# Altium schematic sheet external.SchDoc
size A4; Organization: GPA Robotics; Revision: REV 0
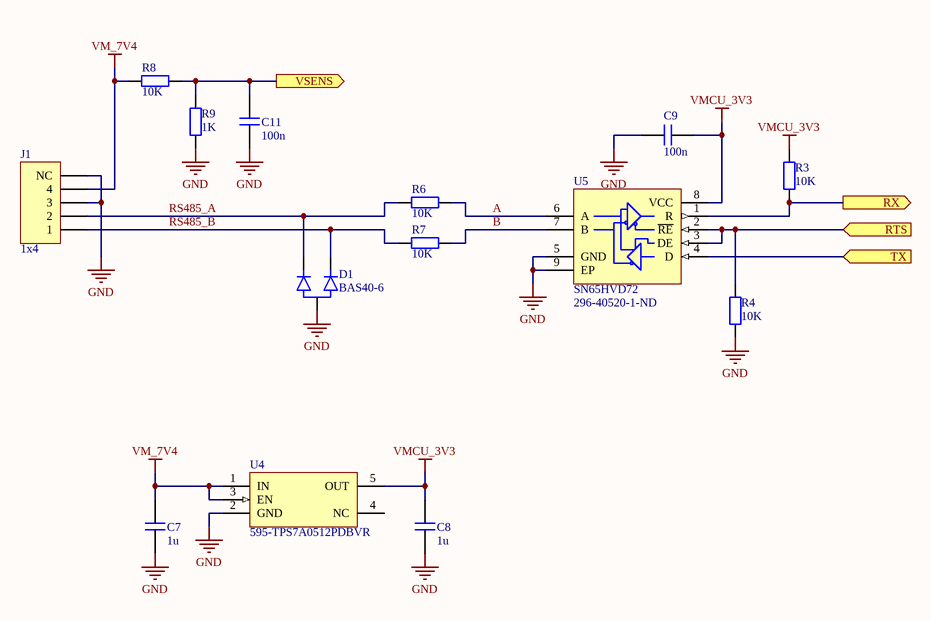
[diagram p0: external.SchDoc]

## Parts
C7  value 1u  [CAPC2012X11N]  (hidden comment: cap)
C8  value 1u  [CAPC2012X11N]  (hidden comment: cap)
C9  value 100n  [CAPC1005X06N]  (hidden comment: cap)
C11  value 100n  [CAPC1005X06N]  (hidden comment: cap)
D1  BAS40-6  [SOT23_CA]
J1  1x4  [sm04b-pass]
R3  value 10K  [RESC1005X04N]  (hidden comment: res)
R4  value 10K  [RESC1005X04N]  (hidden comment: res)
R6  value 10K  [RESC1005X04N]  (hidden comment: res)
R7  value 10K  [RESC1005X04N]  (hidden comment: res)
R8  value 10K  [RESC1005X04N]  (hidden comment: res)
R9  value 1K  [RESC1005X04N]  (hidden comment: res)
U4  595-TPS7A0512PDBVR  [SOT95P280X145-5N]
U5  SN65HVD72  Supplier Part Number 1: 296-40520-1-ND  [SON65P300X100_HS-9N]

## Ports
RTS (in), RX (out), TX (in), VSENS (out)

## Nets
GND: C7.1 C8.1 C9.2 C11.1 D1.A J1.3 J1.ANCHOR(NC) R4.1 R9.1 U4.2(GND) U5.5(GND) U5.9(EP)
VM_7V4: C7.2 J1.4 R8.2 U4.1(IN) U4.3(EN)
VMCU_3V3: C8.2 C9.1 R3.2 U4.5(OUT) U5.8(VCC)
A: R6.2 U5.6(A)
B: R7.2 U5.7(B)
RS485_A: D1.C2 J1.2 R6.1
RS485_B: D1.C1 J1.1 R7.1
RTS: R4.2 U5.2(~{RE}) U5.3(DE) ; port RTS
RX: R3.1 U5.1(R) ; port RX
TX: U5.4(D) ; port TX
VSENS: C11.2 R8.1 R9.2 ; port VSENS

Not connected (* = marked no-connect by the designer): U4 4(NC)

## Notes on the sheet
- Title
- Size:
- Date:
- A4
- Number:
- Time:
- Revision:
- Sheet
- of
- Repo:

## Library data of the parts
C7-C9 C11 = cap: Capacitor; voltage: *; type: *; #digikey: *; #mouser: *
D1 = diode_dual_ca: Diode Common Anode
J1 = sm04b-pass: 2.0mm pitch/Wire-to-board (Crimp style/IDC) / Wire-to-wire (Crimp style/IDC); ComponentLink1Description: Datasheet; ComponentLink1URL: http://www.jst-mfg.com/product/pdf/eng/ePA-F.pdf; #digikey: *; #mouser: *
R3 R4 R6-R9 = res: Resistor; power: *; voltage: *; #digikey: *; #mouser: *
U4 = tps7a0512pdbvr: TPS7A05 1-µA Ultralow IQ, 200-mA, Low-Dropout Regulator; ComponentLink1Description: datasheet; ComponentLink1URL: http://www.ti.com/lit/ds/symlink/tps7a05.pdf?HQS=TI-null-null-mousermode-df-pf-null-wwe&DCM=yes&ref_url=https%3A%2F%2Fwww.mouser.se%2F
U5 = sn65hvd72: 3.3-V Supply RS-485 With IEC ESD Protection; ComponentLink1Description: Datasheet; ComponentLink1URL: http://www.ti.com/lit/ds/symlink/sn65hvd72.pdf; #digikey: *; #mouser: *; Supplier 1: Digi-Key